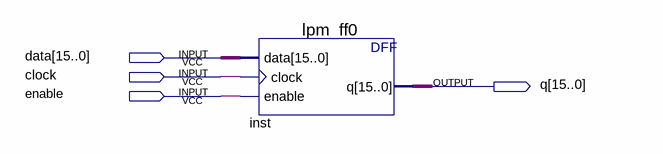
[diagram p0: schematic sheet]
// Quartus schematic ron16.bdf as structural Verilog: 1 symbols, 4 pins
module ron16 (
  input  [15:0] data,
  input  clock,
  input  enable,
  output [15:0] q
);

  lpm_ff0 inst (.data(data), .clock(clock), .enable(enable), .q(q));
endmodule
